# EAGLE design ExerciseTracker (EAGLE 9.6.2)
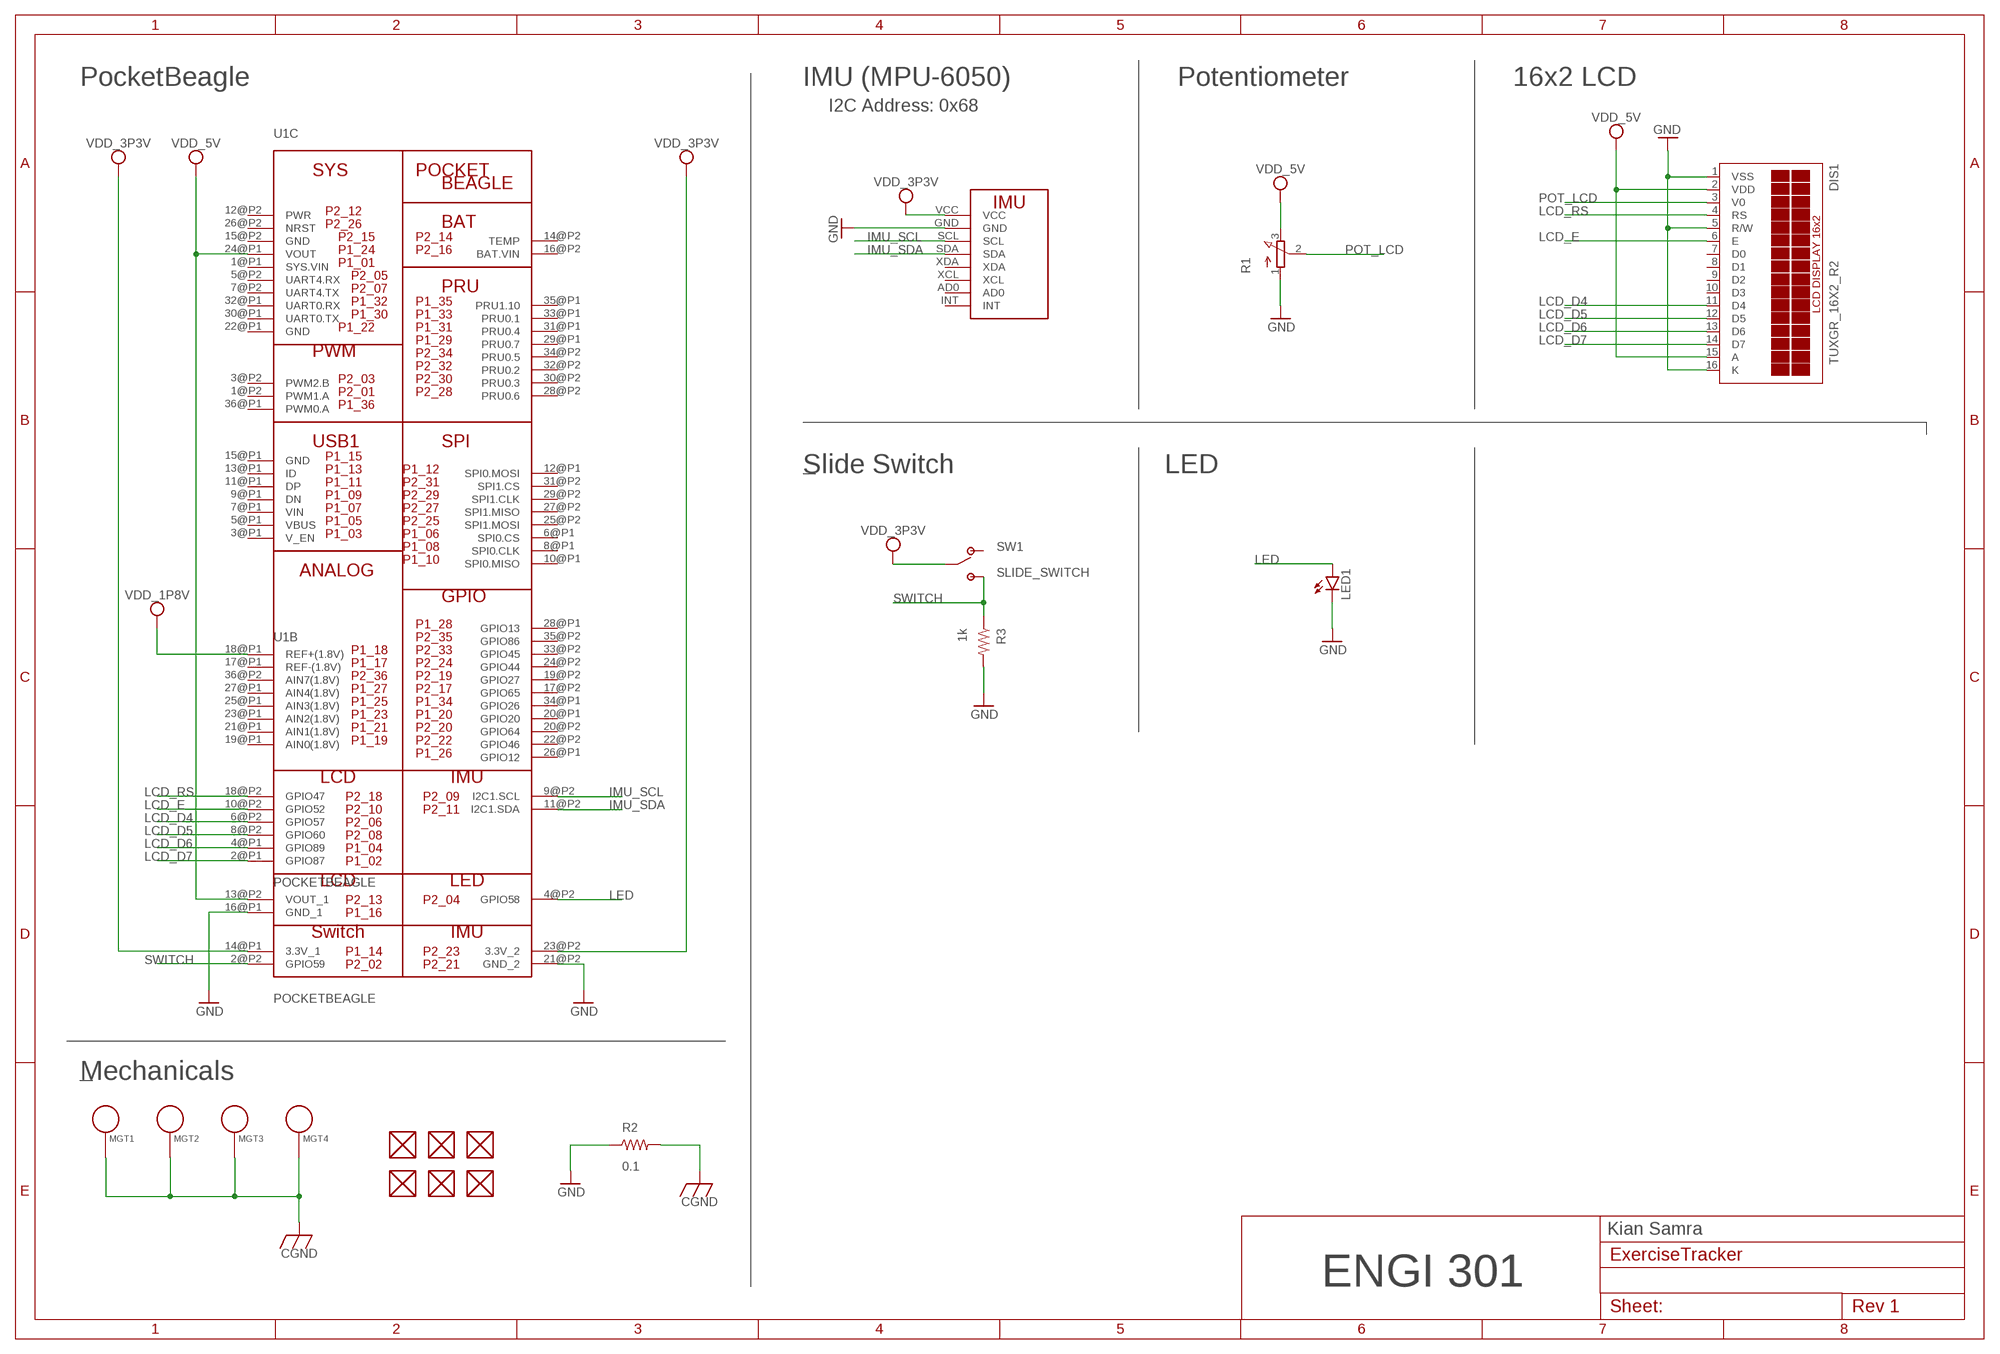
[diagram p0: schematic, sheet 1]

## Parts
DIS1  TUXGR_16X2_R2  [TUXGR_16X2_R2]
FUD2  FIDUCIAL  [FIDUCIAL_40MIL]
FUD3  FIDUCIAL  [FIDUCIAL_40MIL]
FUD4  FIDUCIAL  [FIDUCIAL_40MIL]
FUD5  FIDUCIAL  [FIDUCIAL_40MIL]
FUD6  FIDUCIAL  [FIDUCIAL_40MIL]
FUD7  FIDUCIAL  [FIDUCIAL_40MIL]
LED1  LED5MM  [LED5MM]
MGT1  MOUNTING_HOLE  [MOUNTING_HOLE]
MGT2  MOUNTING_HOLE  [MOUNTING_HOLE]
MGT3  MOUNTING_HOLE  [MOUNTING_HOLE]
MGT4  MOUNTING_HOLE  [MOUNTING_HOLE]
R1  POTENTIOMETER  [3RP/1610N]
R2  0.1  R_R0603  [R0603]
R3  1k  R_R0603  [R0603]
SW1  SLIDE_SWITCH  [JS202011SCQN]
U1  POCKETBEAGLE  [POCKETBEAGLE]
U$2  MPU6050  [MPU6050]

## Nets
CGND: MGT1.P$1 MGT2.P$1 MGT3.P$1 MGT4.P$1 R2.2
GND: DIS1.1(VSS) DIS1.5(R/W) DIS1.16(K) LED1.K(C) R1.1(A) R2.1 R3.2 U1.16@P1(A:GND_1) U1.21@P2(A:GND_2) U$2.GND
IMU_SCL: U1.9@P2(B:I2C1.SCL) U$2.SCL
IMU_SDA: U1.11@P2(B:I2C1.SDA) U$2.SDA
LCD_D4: DIS1.11(D4) U1.6@P2(B:GPIO57)
LCD_D5: DIS1.12(D5) U1.8@P2(B:GPIO60)
LCD_D6: DIS1.13(D6) U1.4@P1(B:GPIO89)
LCD_D7: DIS1.14(D7) U1.2@P1(B:GPIO87)
LCD_E: DIS1.6(E) U1.10@P2(B:GPIO52)
LCD_RS: DIS1.4(RS) U1.18@P2(B:GPIO47)
LED: LED1.A U1.4@P2(A:GPIO58)
POT_LCD: DIS1.3(V0) R1.2(S)
SWITCH: R3.1 SW1.3(POS2) SW1.6(POS2) U1.2@P2(A:GPIO59)
VDD_1P8V: U1.18@P1(C:REF+(1.8V))
VDD_3P3V: SW1.2(COMM) SW1.5(COMM) U1.14@P1(A:3.3V_1) U1.23@P2(A:3.3V_2) U$2.VCC
VDD_5V: DIS1.2(VDD) DIS1.15(A) R1.3(E) U1.13@P2(A:VOUT_1) U1.24@P1(C:VOUT)
Unconnected: DIS1.7(D0) DIS1.8(D1) DIS1.9(D2) DIS1.10(D3) FUD2.P$1 FUD3.P$1 FUD4.P$1 FUD5.P$1 FUD6.P$1 FUD7.P$1 SW1.1(POS1) SW1.4(POS1) U1.1@P1(C:SYS.VIN) U1.1@P2(C:PWM1.A) U1.3@P1(C:V_EN) U1.3@P2(C:PWM2.B) U1.5@P1(C:VBUS) U1.5@P2(C:UART4.RX) U1.6@P1(C:SPI0.CS) U1.7@P1(C:VIN) U1.7@P2(C:UART4.TX) U1.8@P1(C:SPI0.CLK) U1.9@P1(C:DN) U1.10@P1(C:SPI0.MISO) U1.11@P1(C:DP) U1.12@P1(C:SPI0.MOSI) U1.12@P2(C:PWR) U1.13@P1(C:ID) U1.14@P2(C:TEMP) U1.15@P1(C:GND) U1.15@P2(C:GND) U1.16@P2(C:BAT.VIN) U1.17@P1(C:REF-(1.8V)) U1.17@P2(C:GPIO65) U1.19@P1(C:AIN0(1.8V)) U1.19@P2(C:GPIO27) U1.20@P1(C:GPIO20) U1.20@P2(C:GPIO64) U1.21@P1(C:AIN1(1.8V)) U1.22@P1(C:GND) U1.22@P2(C:GPIO46) U1.23@P1(C:AIN2(1.8V)) U1.24@P2(C:GPIO44) U1.25@P1(C:AIN3(1.8V)) U1.25@P2(C:SPI1.MOSI) U1.26@P1(C:GPIO12) U1.26@P2(C:NRST) U1.27@P1(C:AIN4(1.8V)) U1.27@P2(C:SPI1.MISO) U1.28@P1(C:GPIO13) U1.28@P2(C:PRU0.6) U1.29@P1(C:PRU0.7) U1.29@P2(C:SPI1.CLK) U1.30@P1(C:UART0.TX) U1.30@P2(C:PRU0.3) U1.31@P1(C:PRU0.4) U1.31@P2(C:SPI1.CS) U1.32@P1(C:UART0.RX) U1.32@P2(C:PRU0.2) U1.33@P1(C:PRU0.1) U1.33@P2(C:GPIO45) U1.34@P1(C:GPIO26) U1.34@P2(C:PRU0.5) U1.35@P1(C:PRU1.10) U1.35@P2(C:GPIO86) U1.36@P1(C:PWM0.A) U1.36@P2(C:AIN7(1.8V)) U$2.AD0 U$2.INT U$2.XCL U$2.XDA

## Notes on the sheet
- PocketBeagle | IMU (MPU-6050) | Potentiometer | 16x2 LCD
- I2C Address: 0x68
- Slide Switch | LED
- Mechanicals
- Kian Samra
- ENGI 301

## Library data of the parts
DIS1 = ExerciseTracker:TUXGR_16X2_R2: Tuxgraphics LCD display 16x2 characters reflective, without background light Source: tuxgr_12x2_r2.pdf; OC_FARNELL: unknown; OC_NEWARK: unknown
FUD2-FUD7 = ExerciseTracker:FIDUCIAL
LED1 = ExerciseTracker:LED: LED OSRAM: - CHIPLED LG R971, LG N971, LY N971, LG Q971, LY Q971, LO R971, LY R971 LH N974, LH R974 LS Q976, LO Q976, LY Q976 LO Q996 - Hyper CHIPLED LW Q18S LB Q993, LB Q99A, LB R99A - SideLED LS A670, LO A670, LY A670, LG A670, LP A670 LB A673, LV A673, LT A673, LW A673 LH A674 LY A675 LS A676, LA A676, LO A676, LY A676, LW A676 LS A679, LY A679, LG A679 - Hyper Micro SIDELED® LS Y876, LA Y876, LO Y876, LY Y876 LT Y87S - SmartLED LW L88C, LW L88S LB L89C, LB L89S, LG L890 LS L89K, LO L89K, LY L89K LS L896, LA L896, LO L896, LY L896 - TOPLED LS T670, LO T670, LY T670, LG T670, LP T670 LSG T670, LSP T670, LSY T670, LOP T670, LYG T670 LG T671, LOG T671, LSG T671 LB T673, LV T673, LT T673, LW T673 LH T674 LS T676, LA T676, LO T676, LY T676, LB T676, LH T676, LSB T676, LW T676 LB T67C, LV T67C, LT T67C, LS T67K, LO T67K, LY T67K, LW E67C LS E67B, LA E67B, LO E67B, LY E67B, LB E67C, LV E67C, LT E67C LW T67C LS T679, LY T679, LG T679 LS T770, LO T770, LY T770, LG T770, LP T770 LB T773, LV T773, LT T773, LW T773 LH T774 LS E675, LA E675, LY E675, LS T675 LS T776, LA T776, LO T776, LY T776, LB T776 LHGB T686 LT T68C, LB T68C - Hyper Mini TOPLED® LB M676 - Mini TOPLED Santana® LG M470 LS M47K, LO M47K, LY M47K Source: http://www.osram.convergy.de LUXEON: - LUMILED® LXK2-PW12-R00, LXK2-PW12-S00, LXK2-PW14-U00, LXK2-PW14-V00 LXK2-PM12-R00, LXK2-PM12-S00, LXK2-PM14-U00 LXK2-PE12-Q00, LXK2-PE12-R00, LXK2-PE12-S00, LXK2-PE14-T00, LXK2-PE14-U00 LXK2-PB12-K00, LXK2-PB12-L00, LXK2-PB12-M00, LXK2-PB14-N00, LXK2-PB14-P00, LXK2-PB14-Q00 LXK2-PR12-L00, LXK2-PR12-M00, LXK2-PR14-Q00, LXK2-PR14-R00 LXK2-PD12-Q00, LXK2-PD12-R00, LXK2-PD12-S00 LXK2-PH12-R00, LXK2-PH12-S00 LXK2-PL12-P00, LXK2-PL12-Q00, LXK2-PL12-R00 Source: www.luxeon.com KINGBRIGHT: KA-3528ASYC Source: www.kingbright.com
MGT1-MGT4 = ExerciseTracker:MOUNTING_HOLE: Chassis Mounting Hole w/GND connection ability
R1 = ExerciseTracker:POTENTIOMETER: 16mm Potentiometer one level Source: http://www.alphapotentiometers.net/html/16mm_pot_2.html
R2 R3 = ExerciseTracker:R_: RESISTOR, American symbol
SW1 = ExerciseTracker:SLIDE_SWITCH: JS202011SCQN SPDT Slide Switch
U1 = ExerciseTracker:POCKETBEAGLE
U$2 = ExerciseTracker:MPU6050

## Board
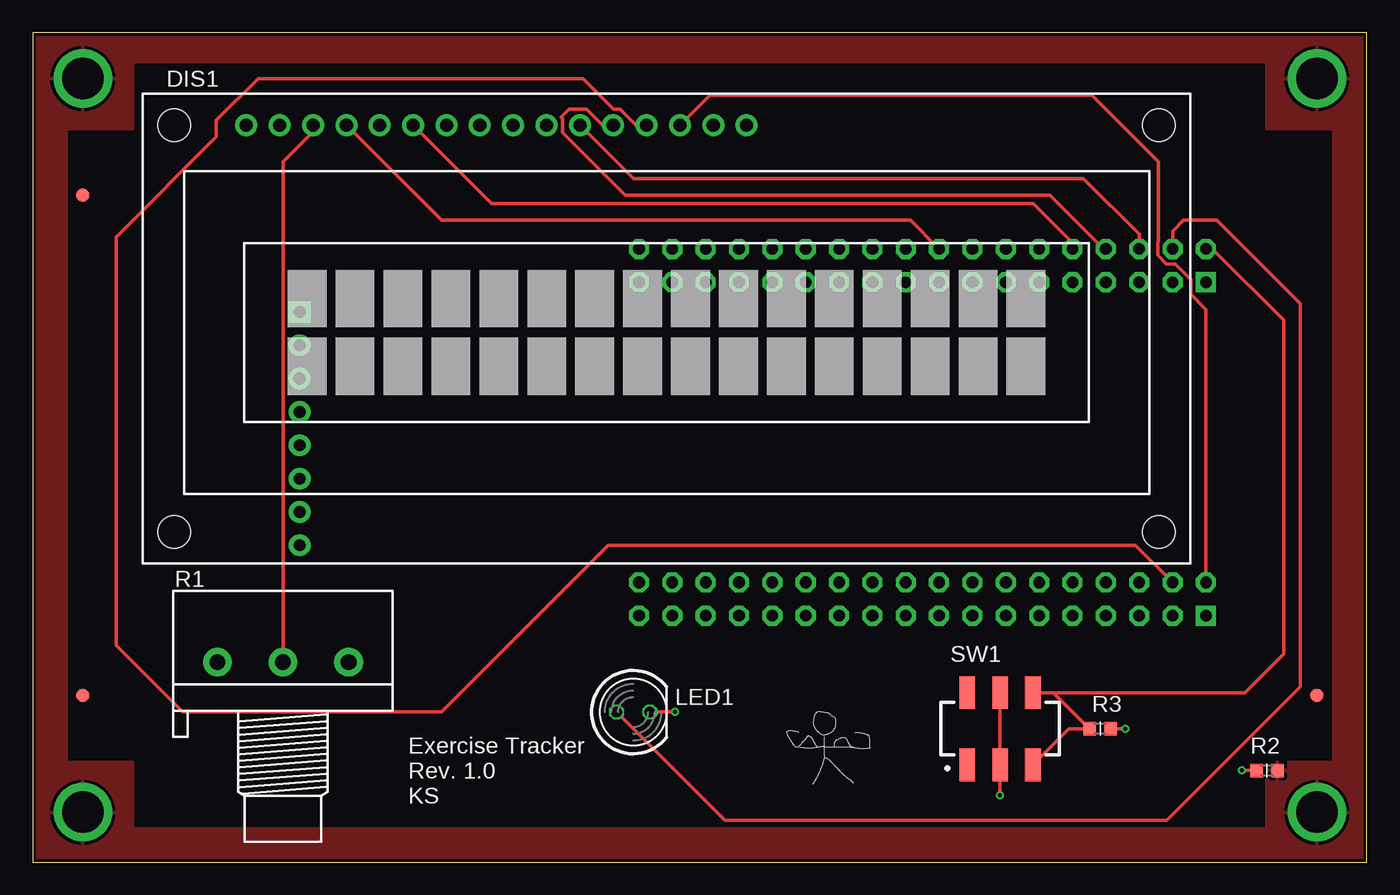
[diagram p1: board, top side]
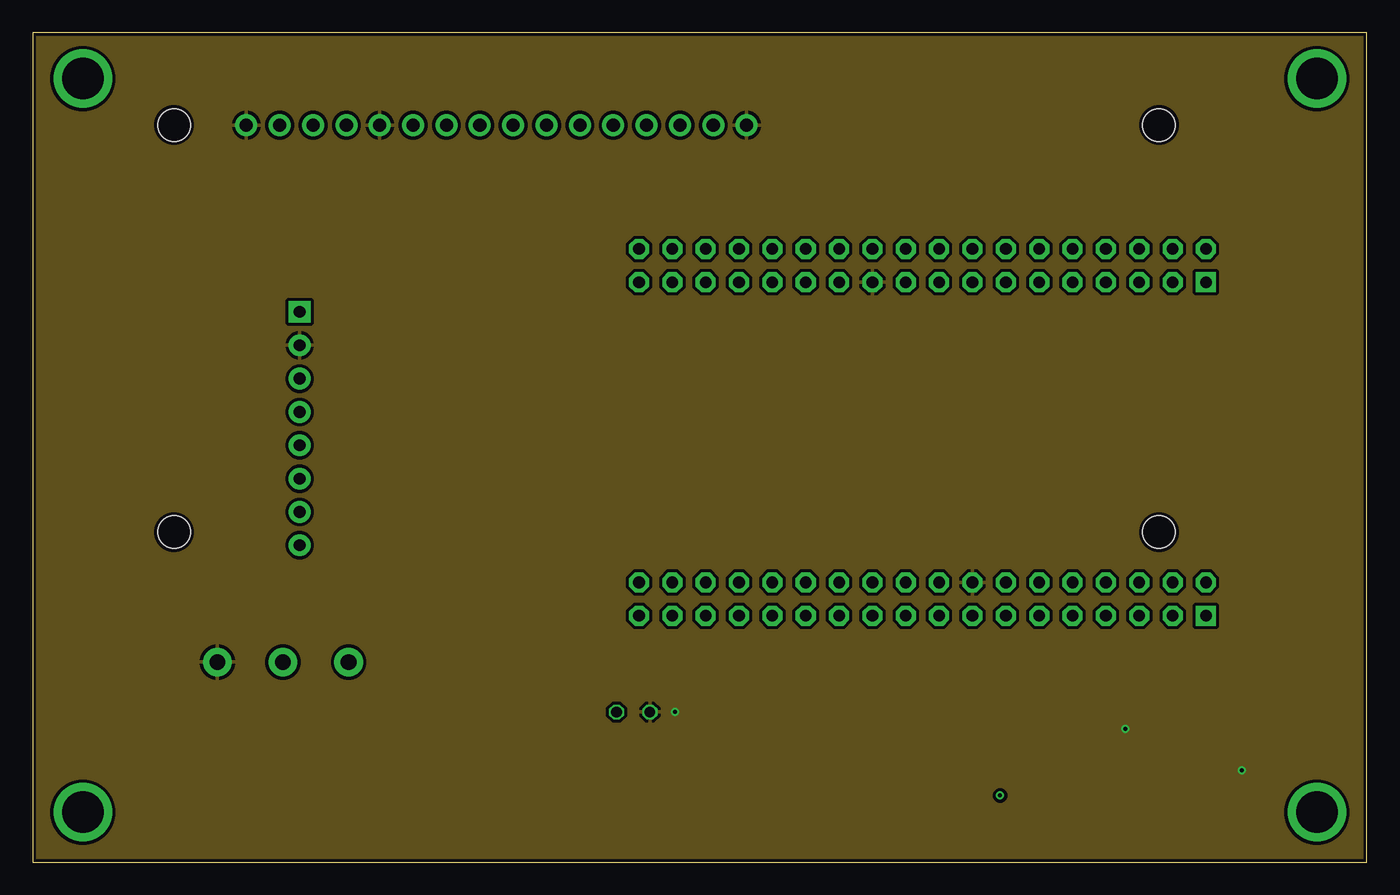
[diagram p2: board, inner layer Route2]
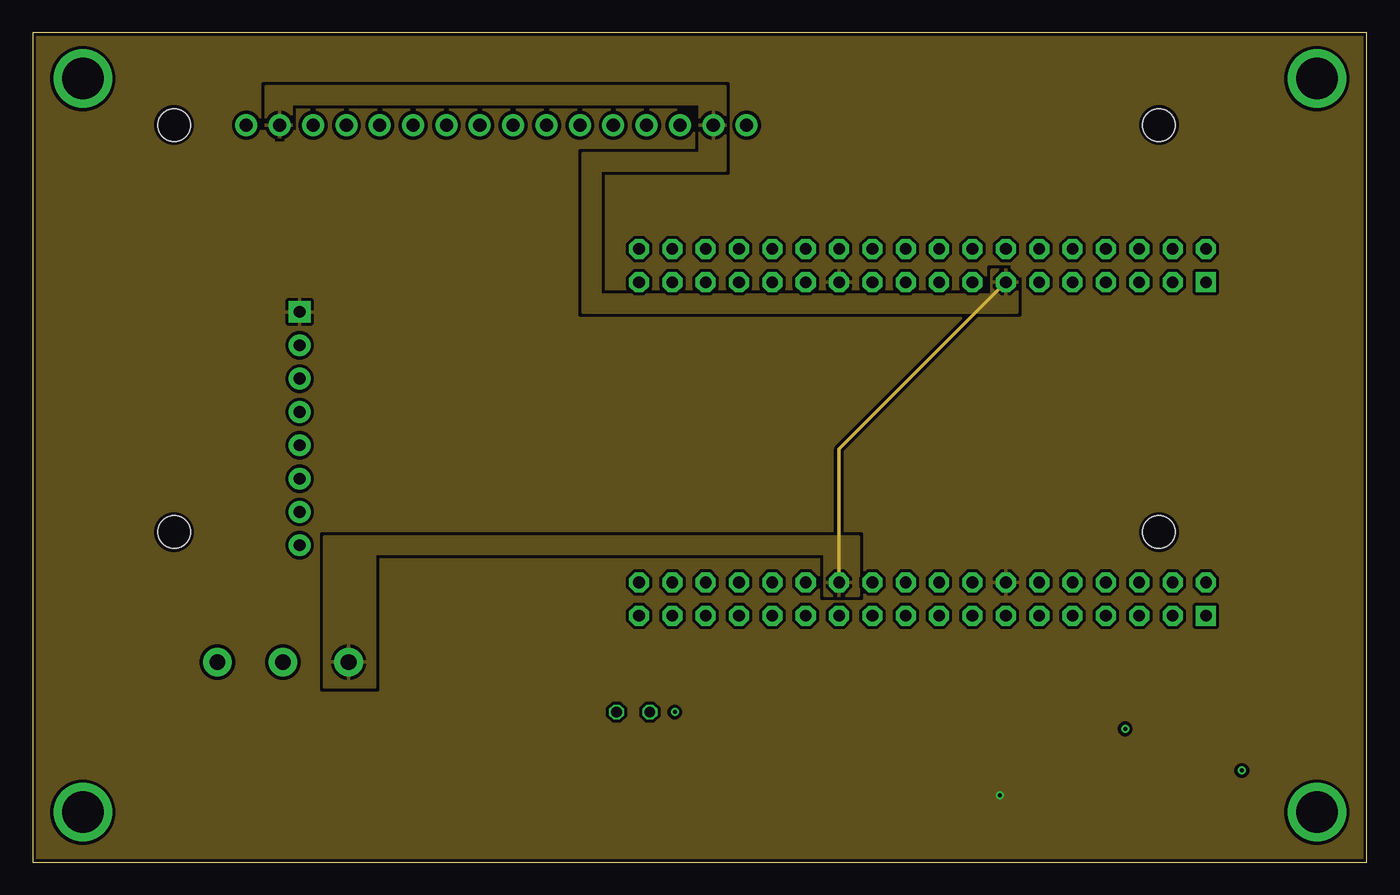
[diagram p3: board, inner layer Route15]
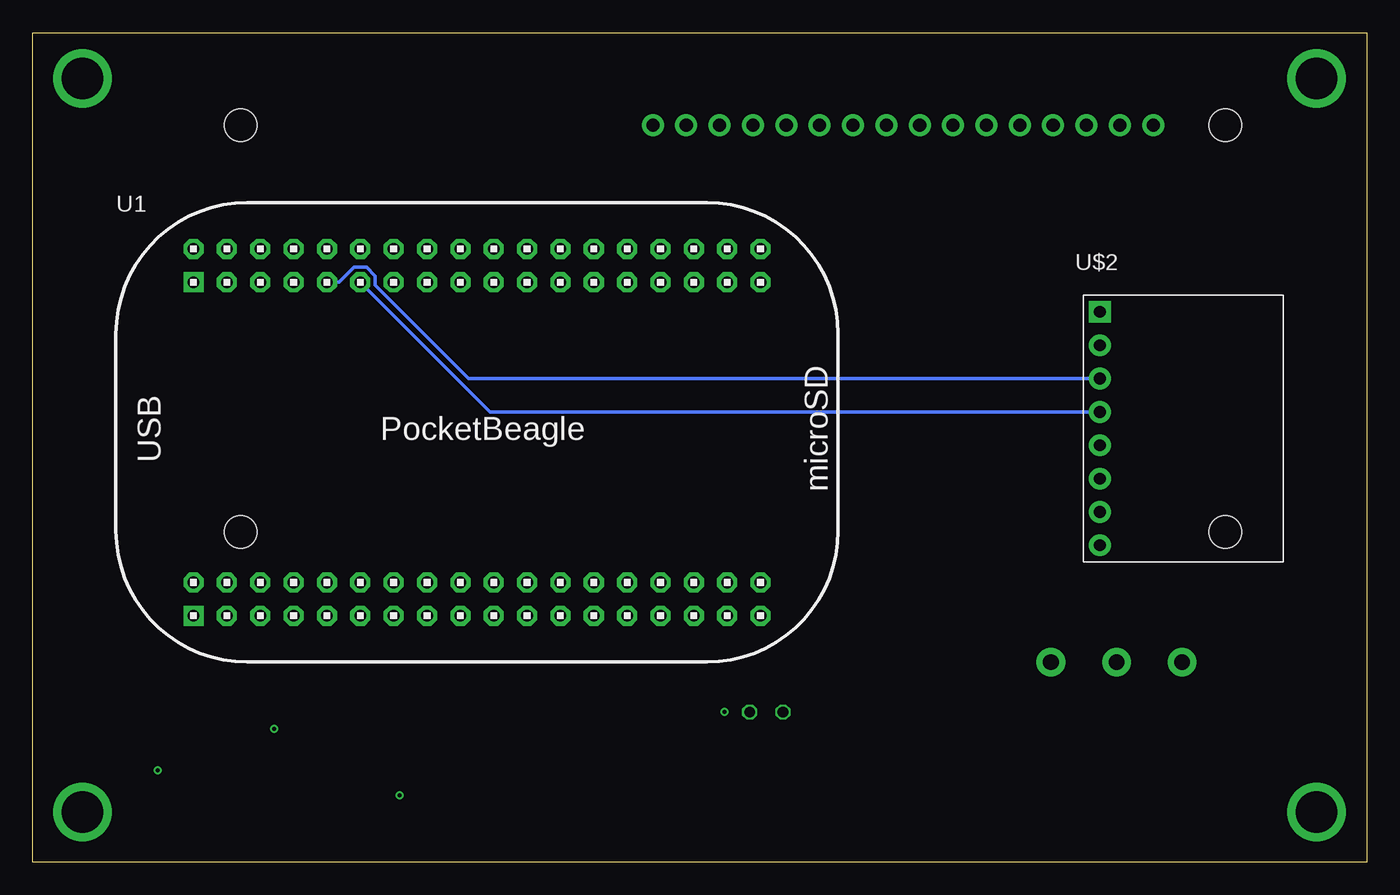
[diagram p4: board, bottom side, seen from below]

Size 101.58 x 63.17 mm. Coordinates in mm from the lower left corner, seen from the top.
Outline: 0,0 101.58,0 101.58,63.17 0,63.17 0,0
Copper layers (1*2*15*16): Top 0.035mm / dielectric 0.23mm / Route2 0.035mm / dielectric 0.93mm / Route15 0.035mm / dielectric 0.23mm / Bottom 0.035mm
Design rules "ENGI301_4lyr": minimum track width 10mil, minimum drill 12mil, track to track 10mil, track to pad 10mil, pad to pad 10mil, via to via 10mil, smd to smd 10mil, copper to edge 10mil, drill to drill 12mil, minimum pad ring 6mil, minimum via ring 6mil, stop-mask expansion 3mil, vias tented up to drill 25mil, thermal gap 10mil

### Footprints (pad centres in the part's own frame; a part is rotated, then mirrored left to right if it is on the bottom)
TUXGR_16X2_R2 = drill 1 pad 1.676: 1 -32,15.5; 2 -29.46,15.5; 3 -26.92,15.5; 4 -24.38,15.5; 5 -21.84,15.5; 6 -19.3,15.5; 7 -16.76,15.5; 8 -14.22,15.5; 9 -11.68,15.5; 10 -9.14,15.5; 11 -6.6,15.5; 12 -4.06,15.5; 13 -1.52,15.5; 14 1.02,15.5; 15 3.56,15.5; 16 6.1,15.5 | hole 2.5: -37.5,-15.5; 37.5,-15.5; -37.5,15.5; 37.5,15.5
FIDUCIAL_40MIL = smd 1.016 x 1.016: P$1 0,0
LED5MM = drill 0.813 octagon: A -1.27,0; K 1.27,0
MOUNTING_HOLE = drill 3.175 pad 4.445: P$1 0,0
3RP/1610N = drill 1.2 pad 2.184: 1 -5,0; 2 0,0; 3 5,0
R0603 = smd 0.95 x 1.031: 1 -0.8,0; 2 0.8,0
JS202011SCQN = smd 1.2 x 2.5: 1 -2.5,-2.75; 2 0,-2.75; 3 2.5,-2.75; 4 -2.5,2.75; 5 0,2.75; 6 2.5,2.75
POCKETBEAGLE = drill 0.889 pad 1.524 square: 1@P1 5.91,3.53; 1@P2 5.91,28.93 | drill 0.889 pad 1.524 octagon: 2@P1 5.91,6.07; 2@P2 5.91,31.47; 3@P1 8.45,3.53; 3@P2 8.45,28.93; 4@P1 8.45,6.07; 4@P2 8.45,31.47; 5@P1 10.99,3.53; 5@P2 10.99,28.93; 6@P1 10.99,6.07; 6@P2 10.99,31.47; 7@P1 13.53,3.53; 7@P2 13.53,28.93; 8@P1 13.53,6.07; 8@P2 13.53,31.47; 9@P1 16.07,3.53; 9@P2 16.07,28.93; 10@P1 16.07,6.07; 10@P2 16.07,31.47; 11@P1 18.61,3.53; 11@P2 18.61,28.93; 12@P1 18.61,6.07; 12@P2 18.61,31.47; 13@P1 21.15,3.53; 13@P2 21.15,28.93; 14@P1 21.15,6.07; 14@P2 21.15,31.47; 15@P1 23.69,3.53; 15@P2 23.69,28.93; 16@P1 23.69,6.07; 16@P2 23.69,31.47; 17@P1 26.23,3.53; 17@P2 26.23,28.93; 18@P1 26.23,6.07; 18@P2 26.23,31.47; 19@P1 28.77,3.53; 19@P2 28.77,28.93; 20@P1 28.77,6.07; 20@P2 28.77,31.47; 21@P1 31.31,3.53; 21@P2 31.31,28.93; 22@P1 31.31,6.07; 22@P2 31.31,31.47; 23@P1 33.85,3.53; 23@P2 33.85,28.93; 24@P1 33.85,6.07; 24@P2 33.85,31.47; 25@P1 36.39,3.53; 25@P2 36.39,28.93; 26@P1 36.39,6.07; 26@P2 36.39,31.47; 27@P1 38.93,3.53; 27@P2 38.93,28.93; 28@P1 38.93,6.07; 28@P2 38.93,31.47; 29@P1 41.47,3.53; 29@P2 41.47,28.93; 30@P1 41.47,6.07; 30@P2 41.47,31.47; 31@P1 44.01,3.53; 31@P2 44.01,28.93; 32@P1 44.01,6.07; 32@P2 44.01,31.47; 33@P1 46.55,3.53; 33@P2 46.55,28.93; 34@P1 46.55,6.07; 34@P2 46.55,31.47; 35@P1 49.09,3.53; 35@P2 49.09,28.93; 36@P1 49.09,6.07; 36@P2 49.09,31.47
MPU6050 = drill 0.889 pad 1.651: AD0 0,0; GND 0,12.7; INT 0,-2.54; SCL 0,10.16; SDA 0,7.62; XCL 0,2.54; XDA 0,5.08 | drill 0.889 pad 1.651 square: VCC 0,15.24

### Placement (x,y rotation side)
DIS1  48.26,40.64 0 top
FUD2  97.79,12.7 0 top
FUD3  97.79,12.7 0 top
FUD4  3.81,12.7 0 top
FUD5  3.81,50.8 0 top
FUD6  3.81,12.7 0 top
FUD7  3.81,50.8 0 top
LED1  45.72,11.43 0 top
MGT1  3.81,3.81 0 top
MGT2  3.81,59.69 0 top
MGT3  97.79,59.69 0 top
MGT4  97.79,3.81 0 top
R1  19.05,15.24 0 top
R2  93.98,6.99 0 top
R3  81.28,10.16 0 top
SW1  73.66,10.16 0 top
U1  95.25,15.24 0 bottom
U$2  20.32,26.67 0 bottom

### Tracks (layer width: path | path; a pad name or v marks a point on that pad's centre or on a via)
CGND
  pour Top: -1.27,31.75 -1.27,-1.27 102.87,-1.27 102.87,31.75 99.06,31.75 99.06,7.62 93.98,7.62 93.98,2.54 7.62,2.54 7.62,7.62 2.54,7.62 2.54,31.75
  pour Top: -1.27,31.75 -1.27,64.77 102.87,64.77 102.87,31.75 99.06,31.75 99.06,55.88 93.98,55.88 93.98,60.96 7.62,60.96 7.62,55.88 2.54,55.88 2.54,31.75
GND  (via drill 0.3 pad 0.61)
  Top 0.254: LED1.K v48.9,11.43 | R3.2 v83.19,10.16 | R2.1 v92.08,6.99
  pour Route2: -2.54,-2.54 104.14,-2.54 104.14,66.04 -2.54,66.04
IMU_SCL
  Bottom 0.254: U$2.SCL 68.38,36.83 75.5,43.95 75.5,44.64 76.17,45.31 77.11,45.31 78.26,44.17 U1.9@P2
IMU_SDA
  Bottom 0.254: U$2.SDA 66.76,34.29 U1.11@P2
LCD_D4
  Top 0.254: DIS1.11 45.73,52.07 80.01,52.07 84.26,47.82 U1.6@P2
LCD_D5
  Top 0.254: DIS1.12 43.38,56.14 42.16,57.36 41.91,57.36 41.7,57.36 40.85,57.36 40.24,56.75 40.34,56.65 40.34,55.55 45.09,50.8 77.47,50.8 81.56,46.71 U1.8@P2
LCD_D6
  Top 0.254: U1.4@P1 83.98,24.13 43.81,24.13 31.11,11.43 11.43,11.43 6.35,16.51 6.35,47.62 13.97,55.24 13.97,56.52 17.14,59.69 41.91,59.69 44.24,57.36 44.7,57.36 45.92,56.14 DIS1.13
LCD_D7
  Top 0.254: U1.2@P1 89.34,42.11 88.2,43.25 88.2,44.39 87.02,45.57 86.33,45.57 85.66,46.24 85.66,47.18 85.72,47.25 85.72,53.34 80.64,58.42 51.56,58.42 DIS1.14
LCD_E
  Top 0.254: DIS1.6 34.94,50.16 76.2,50.16 79.18,47.19 U1.10@P2
LCD_RS
  Top 0.254: DIS1.4 31.12,48.9 66.83,48.9 U1.18@P2
LED
  Top 0.254: LED1.A 52.7,3.17 86.36,3.17 96.52,13.34 96.52,42.55 90.17,48.9 87.63,48.9 86.8,48.06 U1.4@P2
POT_LCD
  Top 0.254: DIS1.3 21.34,55.63 19.05,53.34 R1.2
SWITCH
  Top 0.254: SW1.3 78.91,10.16 R3.1 77.73,12.91 SW1.6 92.28,12.91 95.25,15.88 95.25,41.27 89.81,46.71 U1.2@P2
VDD_3P3V  (via drill 0.3 pad 0.61)
  Top 0.254: v73.66,5.08 SW1.2 SW1.5
  pour Route15 (rank 6): -5.08,68.58 106.68,68.58 106.68,-5.08 -5.08,-5.08
VDD_5V
  Route15 0.254: U1.24@P1 61.4,31.47 U1.13@P2
  pour Route15: 60.33,20.32 62.87,20.32 62.87,24.77 22.23,24.77 22.23,13.34 26.04,13.34 26.04,23.5 60.33,23.5
  pour Route15: 73.03,43.18 73.03,45.09 74.93,45.09 74.93,41.91 41.91,41.91 41.91,53.98 50.8,53.98 50.8,59.05 52.7,59.05 52.7,52.7 43.18,52.7 43.18,43.18
  pour Route15: 50.8,59.05 17.78,59.05 17.78,55.24 19.68,55.24 19.68,57.78 50.8,57.78

### Text on the board
tPlace: Exercise Tracker | Rev. 1.0 | KS
200bmp: C:/Users/Computer/Desktop/Rice University/Sem 7/Engi301/project2/logo.bmp | C:/Users/Computer/Desktop/Rice University/Sem 7/Engi301/project2/logo.bmp